# EAGLE design main (EAGLE 6.5.0)
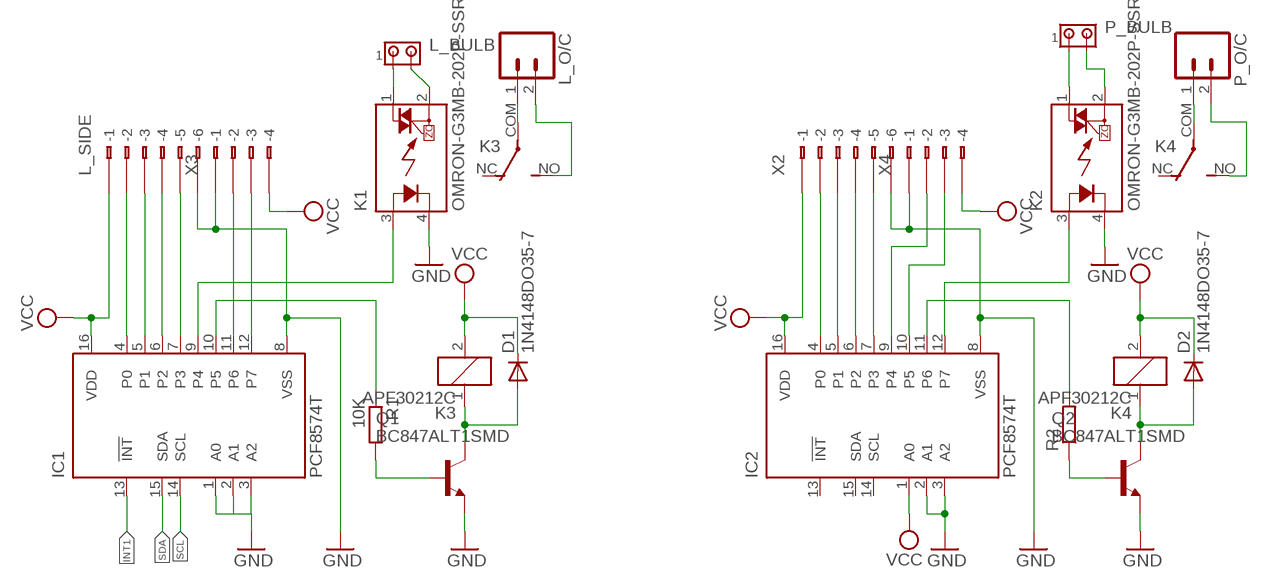
[diagram p0: schematic, sheet 1]

## Parts
D1  1N4148DO35-7  [DO35-7]
D2  1N4148DO35-7  [DO35-7]
IC1  PCF8574T  [SO16W]
IC2  PCF8574T  [SO16W]
K1  OMRON-G3MB-202P-SSR  [OMRON-G3MB-202P-SSR]
K2  OMRON-G3MB-202P-SSR  [OMRON-G3MB-202P-SSR]
K3  APF30212C  [APF30212C]
K4  APF30212C  [APF30212C]
L_BULB  MTA02-156  [1X2MTA]
L_O/C  M02  [02P]
L_SIDE  233-106  [233-106]
P_BULB  MTA02-156  [1X2MTA]
P_O/C  M02  [02P]
Q1  BC847ALT1SMD  [SOT23]
Q2  BC847ALT1SMD  [SOT23]
R1  10K  R-EU_R0805W  [R0805W]
R2  R-EU_R0805W  [R0805W]
X2  233-106  [233-106]
X3  233-104  [233-104]
X4  233-104  [233-104]

## Nets
GND: IC1.1(A0) IC1.2(A1) IC1.3(A2) IC1.8(VSS) IC2.2(A1) IC2.3(A2) IC2.8(VSS) K1.4(K) K2.4(K) L_SIDE.B6(B-6) Q1.2(E) Q2.2(E) X2.B6(B-6) X3.B1(B-1) X4.B1(B-1)
INT1: IC1.13(!INT)
N$1: IC1.4(P0) L_SIDE.B2(B-2)
N$2: IC1.5(P1) L_SIDE.B3(B-3)
N$3: IC1.6(P2) L_SIDE.B4(B-4)
N$4: IC1.7(P3) L_SIDE.B5(B-5)
N$5: IC1.12(P7) X3.B3(B-3)
N$6: IC1.11(P6) X3.B2(B-2)
N$10: IC1.9(P4) K1.3(A)
N$11: K1.2(DS2) L_BULB.2
N$12: K1.1(DS1) L_BULB.1
N$13: K3.COM(2:P) L_O/C.1
N$14: K3.NO(2:S) L_O/C.2
N$15: IC1.10(P5) R1.1
N$16: Q1.1(B) R1.2
N$17: D1.A K3.1 Q1.3(C)
N$18: IC2.7(P3) X2.B5(B-5)
N$19: Q2.1(B) R2.1
N$20: K2.1(DS1) P_BULB.1
N$21: K4.COM(2:P) P_O/C.1
N$22: D2.A K4.1 Q2.3(C)
N$23: K4.NO(2:S) P_O/C.2
N$24: IC2.12(P7) K2.3(A)
N$25: IC2.11(P6) R2.2
N$26: IC2.10(P5) X4.B3(B-3)
N$27: IC2.9(P4) X4.B2(B-2)
N$28: IC2.6(P2) X2.B4(B-4)
N$29: IC2.5(P1) X2.B3(B-3)
N$30: IC2.4(P0) X2.B2(B-2)
N$32: K2.2(DS2) P_BULB.2
SCL: IC1.14(SCL)
SDA: IC1.15(SDA)
VCC: D1.C D2.C IC1.16(VDD) IC2.1(A0) IC2.16(VDD) K3.2 K4.2 L_SIDE.B1(B-1) X2.B1(B-1) X3.B4(B-4) X4.B4(B-4)
Unconnected: IC2.13(!INT) IC2.14(SCL) IC2.15(SDA) K3.NC(2:O) K4.NC(2:O) L_SIDE.A1(-1) L_SIDE.A2(-2) L_SIDE.A3(-3) L_SIDE.A4(-4) L_SIDE.A5(-5) L_SIDE.A6(-6) X2.A1(-1) X2.A2(-2) X2.A3(-3) X2.A4(-4) X2.A5(-5) X2.A6(-6) X3.A1(-1) X3.A2(-2) X3.A3(-3) X3.A4(-4) X4.A1(-1) X4.A2(-2) X4.A3(-3) X4.A4(-4)

## Library data of the parts
D1 D2 = diode:1N4148: DIODE high speed (Philips)
IC1 IC2 = micro-philips:PCF8574: I2C-Bus Remote 8-bit I/O expander http://www.semiconductors.philips.com/acrobat_download/datasheets/PCF8574_4.pdf; MPN: PCF8574T/3,512; OC_FARNELL: 1201255; OC_NEWARK: 70R6870
K1 K2 = Omron-G3MB-202p-SSR:OMRON-G3MB-202P-SSR: IT(rms) 8A, Zero Cross type SIP 4pin Triac output SSR Source: http://sharp-world.com/products/device/lineup/data/pdf/datasheet/s102s02_e.pdf
K3 K4 = relay:APF30212C: Compliant with European standards 1a/1c 6A Slim power relays Source: Data sheet <http://pewa.panasonic.com/assets/pcsd/catalog/pf-catalog.pdf>; OC_FARNELL: unknown
L_BULB P_BULB = con-amp:MTA02-156: AMP connector
L_O/C P_O/C = con-amp-quick:M02: AMP QUICK CONNECTOR; OC_FARNELL: unknown; OC_NEWARK: unknown
L_SIDE X2 = con-wago:233-106: WAGO Cage Clamp; MPN: 233-106; OC_FARNELL: unknown; OC_NEWARK: 28K9048
Q1 Q2 = transistor-npn:BC847*: NPN Transistor
R1 R2 = rcl:R-EU_: RESISTOR, European symbol
X3 X4 = con-wago:233-104: WAGO Cage Clamp; MPN: 233-104; OC_FARNELL: unknown; OC_NEWARK: 28K9046

## Board
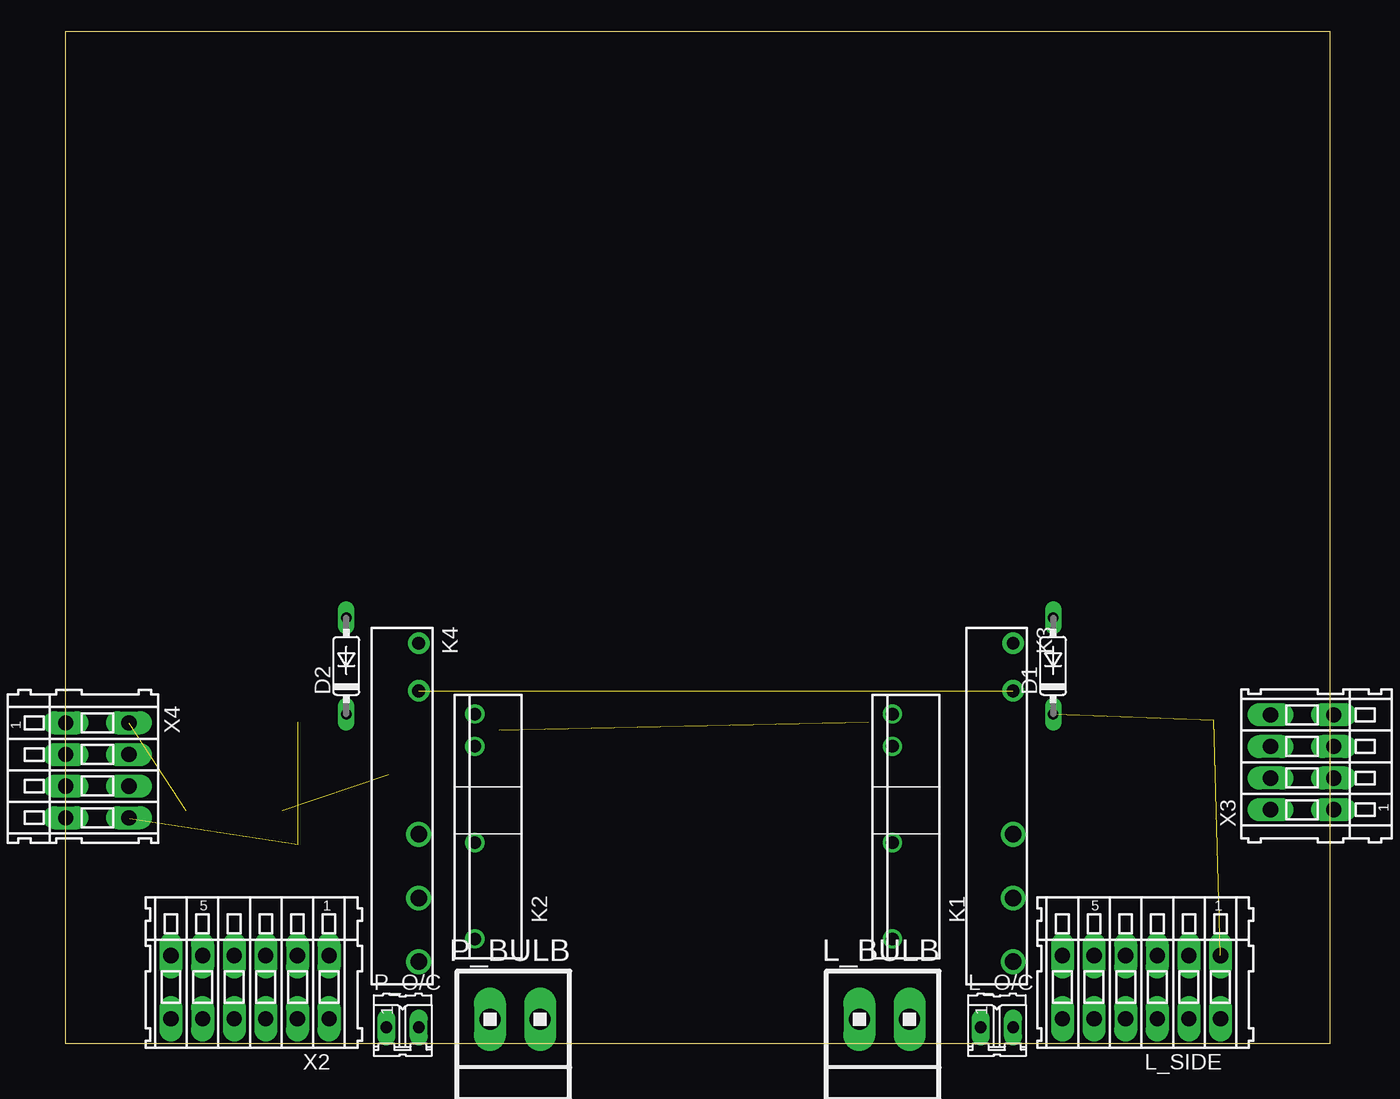
[diagram p1: board, top side]
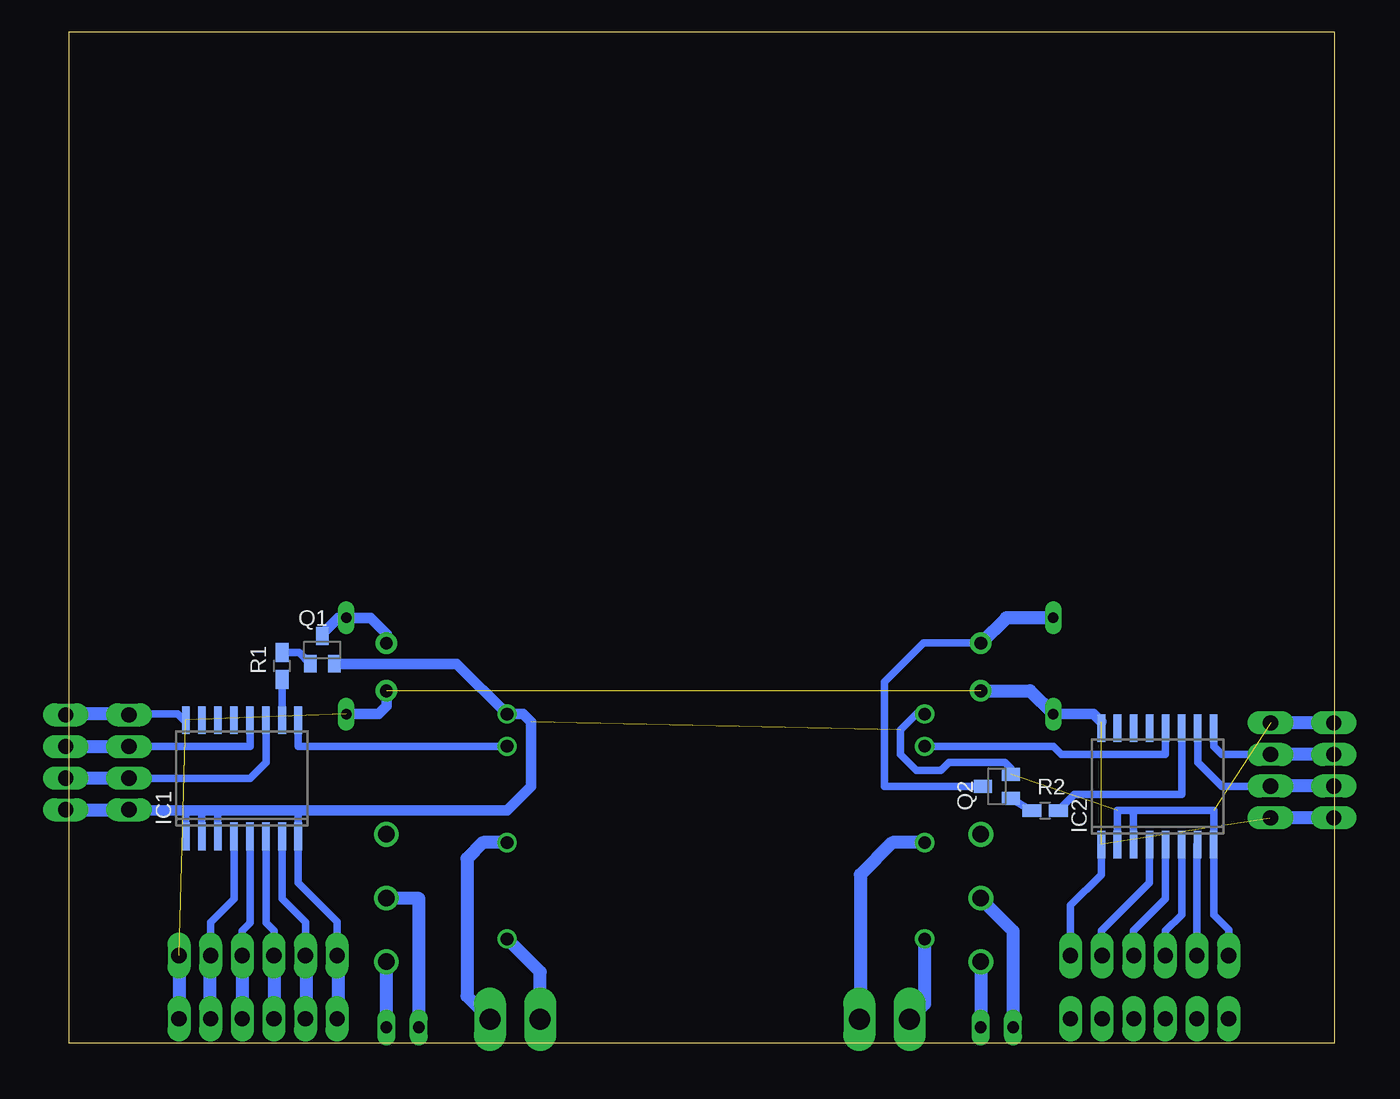
[diagram p2: board, bottom side, seen from below]

Size 100 x 80 mm. Coordinates in mm from the lower left corner, seen from the top.
Outline: 0,0 100,0 100,80 0,80 0,0
Copper layers (1*16): Top 0.035mm / dielectric 1.5mm / Bottom 0.035mm
Design rules "default": minimum track width 10mil, minimum drill 24mil, track to track 8mil, track to pad 8mil, pad to pad 8mil, via to via 8mil, smd to smd 8mil, copper to edge 40mil, drill to drill 8mil, minimum pad ring 10mil, minimum via ring 8mil, stop-mask expansion 4mil, vias tented up to drill 0mil, thermal gap 10mil

### Footprints (pad centres in the part's own frame; a part is rotated, then mirrored left to right if it is on the bottom)
DO35-7 = drill 0.813 long: A 3.81,0; C -3.81,0
SO16W = smd 0.6 x 2.2: 1 -4.445,-4.6; 2 -3.175,-4.6; 3 -1.905,-4.6; 4 -0.635,-4.6; 5 0.635,-4.6; 6 1.905,-4.6; 7 3.175,-4.6; 8 4.445,-4.6; 9 4.445,4.6; 10 3.175,4.6; 11 1.905,4.6; 12 0.635,4.6; 13 -0.635,4.6; 14 -1.905,4.6; 15 -3.175,4.6; 16 -4.445,4.6
OMRON-G3MB-202P-SSR = drill 1: 1 -10.16,0; 2 -2.54,0; 3 5.08,0; 4 7.62,0
APF30212C = drill 1 pad 1.7: 1 -12.6,0; 2 -8.82,0 | drill 1.3 pad 1.9: COM 7.56,0; NC 2.52,0; NO 12.6,0
1X2MTA = drill 1.676 long: 1 1.981,0; 2 -1.981,0
02P = drill 0.914 long: 1 -1.27,0; 2 1.27,0
233-106 = drill 1.2 long: A1 -6.25,2.5; A2 -3.75,2.5; A3 -1.25,2.5; A4 1.25,2.5; A5 3.75,2.5; A6 6.25,2.5; B1 -6.25,-2.5; B2 -3.75,-2.5; B3 -1.25,-2.5; B4 1.25,-2.5; B5 3.75,-2.5; B6 6.25,-2.5
SOT23 = smd 1 x 1.4: 1 -0.95,-1.1; 2 0.95,-1.1; 3 0,1.1
R0805W = smd 1.5 x 1: 1 -1.052,0; 2 1.052,0
233-104 = drill 1.2 long: A1 -3.75,2.5; A2 -1.25,2.5; A3 1.25,2.5; A4 3.75,2.5; B1 -3.75,-2.5; B2 -1.25,-2.5; B3 1.25,-2.5; B4 3.75,-2.5

### Placement (x,y rotation side)
D1  78.11,29.84 90 top
D2  22.23,29.84 90 top
IC1  86.36,20.95 0 bottom
IC2  13.97,20.32 0 bottom
K1  65.41,18.41 90 top
K2  32.38,18.41 90 top
K3  74.93,19.05 270 top
K4  27.94,19.05 270 top
L_BULB  64.77,1.91 180 top
L_O/C  73.66,1.27 0 top
L_SIDE  85.09,4.45 180 top
P_BULB  35.56,1.91 180 top
P_O/C  26.67,1.27 0 top
Q1  80.01,31.11 0 bottom
Q2  26.67,20.32 90 bottom
R1  83.19,29.84 90 bottom
R2  22.86,18.41 0 bottom
X2  14.61,4.45 180 top
X3  97.79,22.23 90 top
X4  2.54,21.59 270 top

### Tracks (layer width: path | path; a pad name or v marks a point on that pad's centre or on a via)
GND  (3 unrouted)
  Bottom 0.61: L_SIDE.B6 78.84,9.62 81.92,12.7 IC1.8 81.92,18.41 | IC1.3 88.27,18.41 | IC1.2 89.53,18.41 | IC1.1 90.81,18.41 | X2.B6 8.36,8.99 9.53,10.16 IC2.8 9.53,18.41 15.88,18.41 | IC2.3 15.88,18.41 | 15.88,18.41 17.14,18.41 IC2.2 | Q2.2 25.57,21.76 26.04,22.23 30.48,22.23 31.11,21.59 33.02,21.59 34.29,22.86 34.29,24.77 33.02,26.04 K2.4
  Bottom 0.813: 94.61,18.41 90.81,18.41 89.53,18.41 88.27,18.41 81.92,18.41 65.41,18.41 63.5,20.32 63.5,25.4 64.14,26.04 K1.4 69.39,30.02 Q1.2
  Bottom 1.016: 94.61,18.41 100.23,18.41 X3.B1 | X4.B1 5.02,25.34 5.08,25.4
N$1
  Bottom 0.61: IC1.4 87,11.43 88.84,9.59 L_SIDE.B2
N$2
  Bottom 0.61: IC1.5 85.72,9.53 86.36,8.89 86.36,6.99 86.36,6.96 L_SIDE.B3
  Bottom 1.016: 86.36,6.99 86.36,1.91
N$3
  Bottom 0.61: IC1.6 84.45,9.53 83.82,8.89 83.82,6.99 83.82,6.96 L_SIDE.B4
  Bottom 1.016: 83.82,6.99 83.82,1.91
N$4
  Bottom 0.61: IC1.7 83.19,11.43 81.34,9.59 L_SIDE.B5
N$5
  Bottom 0.61: IC1.12 85.72,23.5 95.25,23.5
  Bottom 1.016: X3.B3 95.27,23.48 95.25,23.5
N$6
  Bottom 0.61: IC1.11 84.45,22.23 85.72,20.95 95.25,20.95
  Bottom 1.016: X3.B2 95.27,20.98 95.25,20.95
N$7
  Bottom 1.016: 78.74,6.99 78.74,1.91
N$8
  Bottom 1.016: 81.28,6.99 81.28,1.91
N$9
  Bottom 1.016: 88.9,6.99 88.9,1.91
N$10
  Bottom 0.61: K1.3 81.92,23.5 IC1.9
N$11
  Bottom 1.016: K1.2 67.31,15.88 68.58,14.61 68.58,3.73 L_BULB.2
N$12
  Bottom 1.016: L_BULB.1 62.79,5.64 K1.1
N$13
  Bottom 1.016: K3.COM 72.45,11.49 72.39,11.43 L_O/C.1
N$14
  Bottom 1.016: L_O/C.2 K3.NO
N$15
  Bottom 0.61: IC1.10 R1.1
N$16
  Bottom 0.61: R1.2 81.84,30.9 Q1.1
N$17
  Bottom 0.813: K3.1 74.93,32.38 76.2,33.66 D1.A 78.74,33.66 80.01,32.38 Q1.3
N$18
  Bottom 0.61: IC2.7 10.86,15.72 X2.B5
N$19
  Bottom 0.61: R2.1 23.98,18.41 Q2.1
N$20
  Bottom 1.016: K2.1 32.38,3.1 P_BULB.1
N$21
  Bottom 1.016: K4.COM 27.94,11.43 25.4,8.89 P_O/C.1
N$22
  Bottom 0.61: Q2.3 35.56,20.32 35.56,28.57 32.48,31.65 K4.1
  Bottom 1.016: D2.A 25.93,33.66 K4.1
N$23
  Bottom 1.016: K4.NO P_O/C.2
N$24
  Bottom 0.61: IC2.12 13.34,22.86 21.59,22.86 22.23,23.5 K2.3
N$25
  Bottom 0.61: IC2.11 12.06,19.68 20.54,19.68 R2.2
N$26
  Bottom 0.61: 5.08,20.32 8.89,20.32 10.79,22.23 IC2.10
  Bottom 1.016: X4.B3 5.08,20.34 5.08,20.32
N$27
  Bottom 0.61: IC2.9 9.53,23.5 8.87,22.84 5.08,22.84
  Bottom 1.016: X4.B2 5.08,22.84 5.08,22.86
N$28
  Bottom 0.61: IC2.6 12.06,10.16 13.34,8.89 13.34,6.96 X2.B4
N$29
  Bottom 0.61: IC2.5 13.34,11.43 15.88,8.89 15.88,6.96 X2.B3
N$30
  Bottom 0.61: IC2.4 14.61,12.7 18.41,8.89 18.41,7 X2.B2
N$32
  Bottom 1.016: K2.2 34.92,15.88 37.47,13.34 37.47,1.98 P_BULB.2
VCC  (6 unrouted)
  Bottom 0.61: IC1.16 90.96,25.55 91.44,26.04 94.61,26.04 | IC2.1 18.41,13.34 20.86,10.89 X2.B1
  Bottom 0.813: D1.C 75.56,26.04 74.93,26.67 K3.2 | D2.C 19.05,26.04 18.41,25.4
  Bottom 1.016: L_SIDE.B1 91.34,2 91.44,1.91 | 94.61,26.04 100.23,26.04 X3.B4 | X4.B4 5.02,17.84 5.08,17.78 | K4.2 24.06,27.87 D2.C